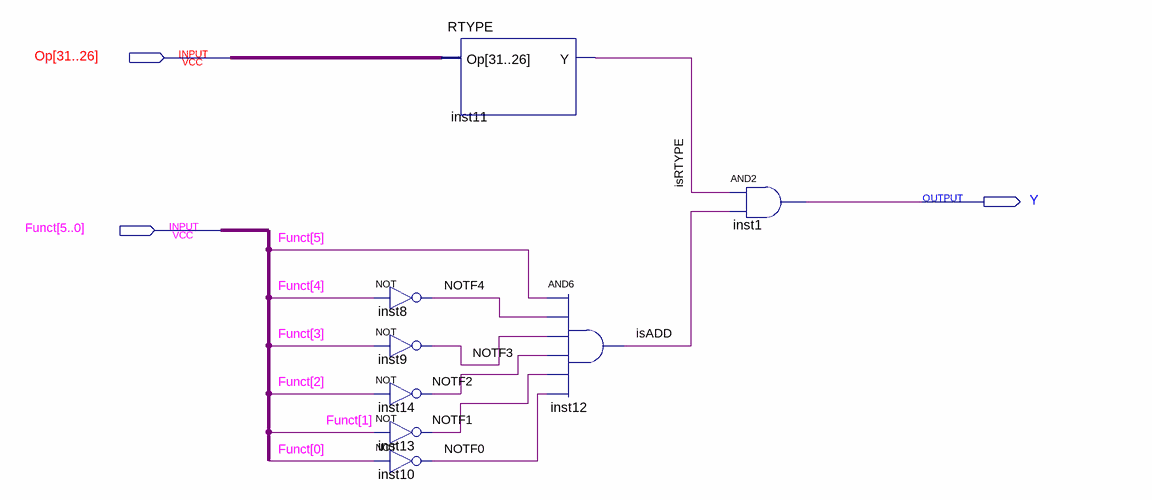
[diagram p0: schematic sheet]
// Quartus schematic ADD.bdf as structural Verilog: 8 symbols, 3 pins
module ADD (
  input  [31:26] Op,
  input  [5:0] Funct,
  output Y
);

  wire isADD, isRTYPE, NOTF0, NOTF1, NOTF2, NOTF3, NOTF4;

  not inst8 (NOTF4, Funct[4]);
  not inst9 (NOTF3, Funct[3]);
  not inst14 (NOTF2, Funct[2]);
  not inst13 (NOTF1, Funct[1]);
  not inst10 (NOTF0, Funct[0]);
  RTYPE inst11 (.Op(Op), .Y(isRTYPE));
  and inst12 (isADD, Funct[5], NOTF4, NOTF3, NOTF2, NOTF1, NOTF0);
  and inst1 (Y, isRTYPE, isADD);
endmodule
